# Altium schematic sheet led.SchDoc
size A3; Organization: Develer s.r.l.; Address1: via Mugellese 1/A; Address2: 50019 Campi Bisenzio; Address3: Firenze; Address4: ITALY; Revision: A; SheetNumber: 1; SheetTotal: 1
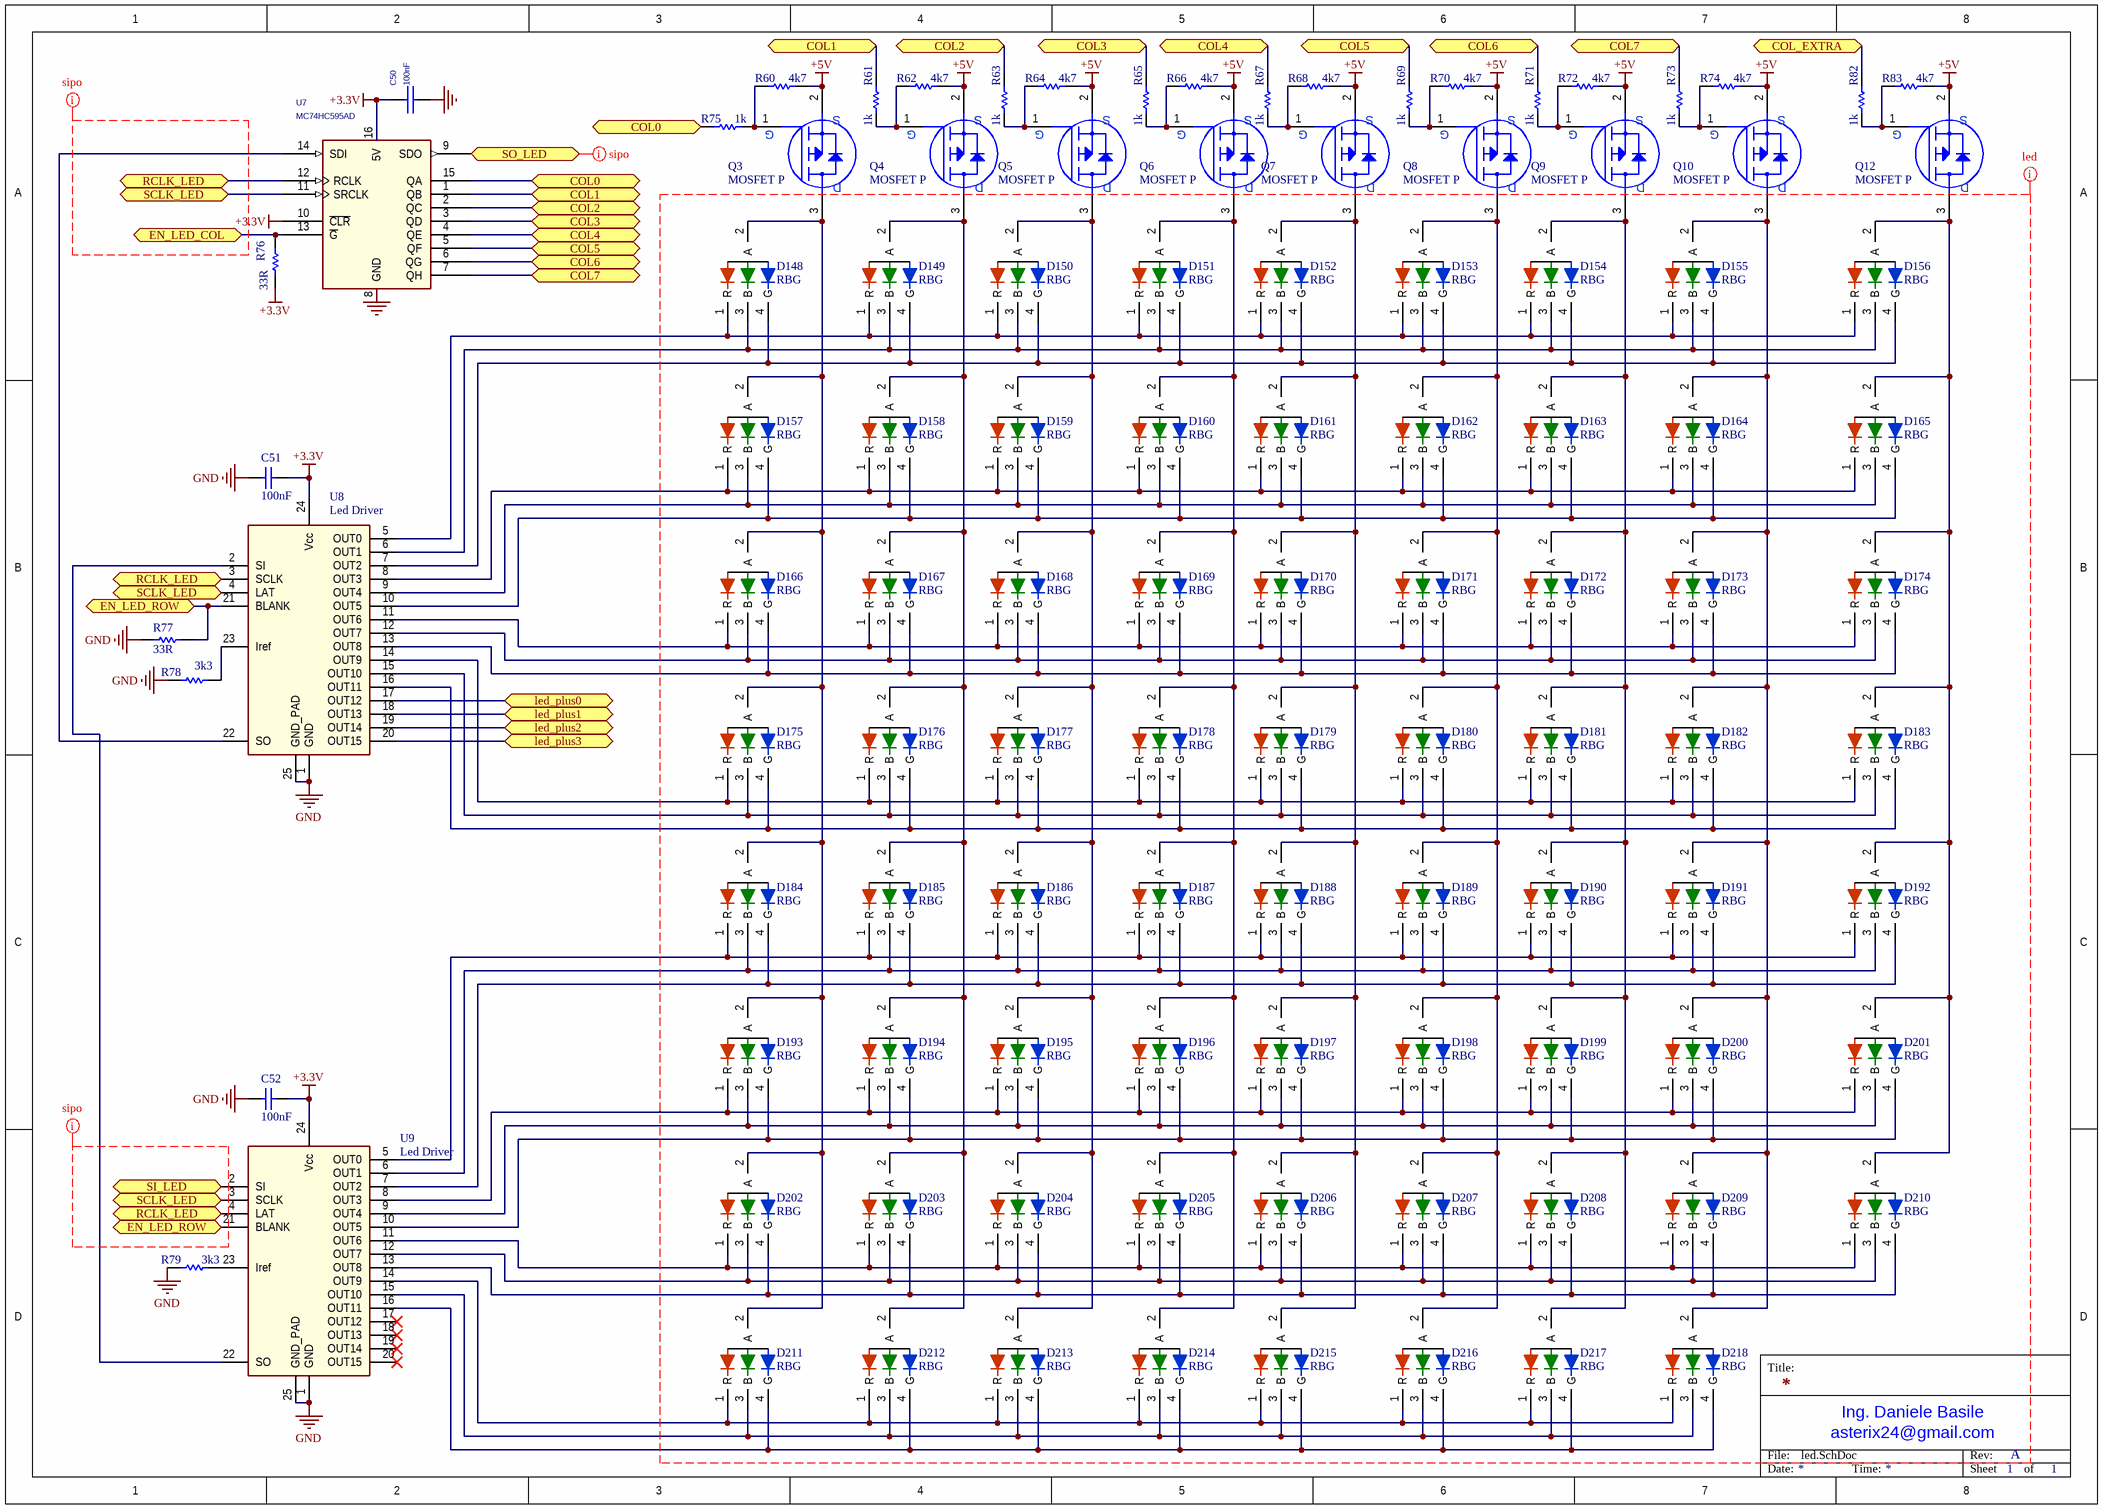
[diagram p0: led.SchDoc]

## Parts
C50  100nF  [0603_[1608]]
C51  100nF  [0603_[1608]]
C52  100nF  [0603_[1608]]
D148  RBG
D149  RBG  [led_3.2x2.8mm_4p_smd]
D150  RBG  [led_3.2x2.8mm_4p_smd]
D151  RBG  [led_3.2x2.8mm_4p_smd]
D152  RBG
D153  RBG  [led_3.2x2.8mm_4p_smd]
D154  RBG
D155  RBG
D156  RBG  [R3_RGB_LED_THD]
D157  RBG  [R3_RGB_LED_THD]
D158  RBG  [R3_RGB_LED_THD]
D159  RBG  [R3_RGB_LED_THD]
D160  RBG
D161  RBG
D162  RBG
D163  RBG
D164  RBG  [led_3.2x2.8mm_4p_smd]
D165  RBG  [R3_RGB_LED_THD]
D166  RBG  [R3_RGB_LED_THD]
D167  RBG  [R3_RGB_LED_THD]
D168  RBG  [R3_RGB_LED_THD]
D169  RBG
D170  RBG
D171  RBG
D172  RBG
D173  RBG  [R3_RGB_LED_THD]
D174  RBG  [R3_RGB_LED_THD]
D175  RBG  [R3_RGB_LED_THD]
D176  RBG  [R3_RGB_LED_THD]
D177  RBG
D178  RBG
D179  RBG
D180  RBG
D181  RBG  [R3_RGB_LED_THD]
D182  RBG  [R3_RGB_LED_THD]
D183  RBG  [R3_RGB_LED_THD]
D184  RBG  [R3_RGB_LED_THD]
D185  RBG
D186  RBG
D187  RBG
D188  RBG
D189  RBG  [R3_RGB_LED_THD]
D190  RBG  [R3_RGB_LED_THD]
D191  RBG  [R3_RGB_LED_THD]
D192  RBG  [R3_RGB_LED_THD]
D193  RBG
D194  RBG
D195  RBG
D196  RBG
D197  RBG  [R3_RGB_LED_THD]
D198  RBG  [R3_RGB_LED_THD]
D199  RBG  [R3_RGB_LED_THD]
D200  RBG  [led_3.2x2.8mm_4p_smd]
D201  RBG  [R3_RGB_LED_THD]
D202  RBG
D203  RBG
D204  RBG
D205  RBG
D206  RBG  [R3_RGB_LED_THD]
D207  RBG  [R3_RGB_LED_THD]
D208  RBG  [R3_RGB_LED_THD]
D209  RBG  [R3_RGB_LED_THD]
D210  RBG
D211  RBG
D212  RBG  [R3_RGB_LED_THD]
D213  RBG  [R3_RGB_LED_THD]
D214  RBG  [R3_RGB_LED_THD]
D215  RBG  [R3_RGB_LED_THD]
D216  RBG  [R3_RGB_LED_THD]
D217  RBG  [R3_RGB_LED_THD]
D218  RBG  [R3_RGB_LED_THD]
Q3  MOSFET P  [SOT-23]
Q4  MOSFET P  [SOT-23]
Q5  MOSFET P  [SOT-23]
Q6  MOSFET P  [SOT-23]
Q7  MOSFET P  [SOT-23]
Q8  MOSFET P  [SOT-23]
Q9  MOSFET P  [SOT-23]
Q10  MOSFET P  [SOT-23]
Q12  MOSFET P  [SOT-23]
R60  4k7  [0603_[1608]]
R61  1k  [0603_[1608]]
R62  4k7  [0603_[1608]]
R63  1k  [0603_[1608]]
R64  4k7  [0603_[1608]]
R65  1k  [0603_[1608]]
R66  4k7  [0603_[1608]]
R67  1k  [0603_[1608]]
R68  4k7  [0603_[1608]]
R69  1k  [0603_[1608]]
R70  4k7  [0603_[1608]]
R71  1k  [0603_[1608]]
R72  4k7  [0603_[1608]]
R73  1k  [0603_[1608]]
R74  4k7  [0603_[1608]]
R75  1k  [0603_[1608]]
R76  33R  [0603_[1608]]
R77  33R  [0603_[1608]]
R78  3k3  [0805_[2012]]
R79  3k3  [0805_[2012]]
R82  1k  [0603_[1608]]
R83  4k7  [0603_[1608]]
U7  MC74HC595AD  [SOIC16]
U8  Led Driver  [TSOP65P640X120_HS-25N]
U9  Led Driver  [TSOP65P640X120_HS-25N]

## Ports
COL0, COL1, COL2, COL3, COL4, COL5, COL6, COL7, COL_EXTRA, EN_LED_COL, EN_LED_ROW, led_plus0, led_plus1, led_plus2, led_plus3, RCLK_LED, SCLK_LED, SI_LED, SO_LED

## Nets
+3.3V: C50.1 C51.2 C52.2 R76.1 U7.10(~{CLR}) U7.16(5V) U8.24(Vcc) U9.24(Vcc)  [also labelled 5V]
+5V: Q3.2(S) Q4.2(S) Q5.2(S) Q6.2(S) Q7.2(S) Q8.2(S) Q9.2(S) Q10.2(S) Q12.2(S) R60.1 R62.1 R64.1 R66.1 R68.1 R70.1 R72.1 R74.1 R83.1
GND: C50.2 C51.1 C52.1 R77.1 R78.1 R79.1 U7.8(GND) U8.1(GND) U8.25(GND_PAD) U9.1(GND) U9.25(GND_PAD)
COL0: R75.2 U7.15(QA) ; port COL0
COL1: R61.1 U7.1(QB) ; port COL1
COL2: R63.1 U7.2(QC) ; port COL2
COL3: R65.1 U7.3(QD) ; port COL3
COL4: R67.1 U7.4(QE) ; port COL4
COL5: R69.1 U7.5(QF) ; port COL5
COL6: R71.1 U7.6(QG) ; port COL6
COL7: R73.1 U7.7(QH) ; port COL7
COL_EXTRA: R82.1 ; port COL_EXTRA
EN_LED_COL: R76.2 U7.13(~{G}) ; port EN_LED_COL
EN_LED_ROW: R77.2 U8.21(BLANK) U9.21(BLANK) ; port EN_LED_ROW
led_plus0: U8.17(OUT12) ; port led_plus0
led_plus1: U8.18(OUT13) ; port led_plus1
led_plus2: U8.19(OUT14) ; port led_plus2
led_plus3: U8.20(OUT15) ; port led_plus3
RCLK_LED: U7.12(RCLK) U8.3(SCLK) U9.4(LAT) ; port RCLK_LED
SCLK_LED: U7.11(SRCLK) U8.4(LAT) U9.3(SCLK) ; port SCLK_LED
SI_LED: U9.2(SI) ; port SI_LED
SO_LED: U7.9(SDO) ; port SO_LED
NetD148_1: D148.1(R) D149.1(R) D150.1(R) D151.1(R) D152.1(R) D153.1(R) D154.1(R) D155.1(R) D156.1(R) U8.5(OUT0)
NetD148_2: D148.2(A) D157.2(A) D166.2(A) D175.2(A) D184.2(A) D193.2(A) D202.2(A) D211.2(A) Q3.3(D)
NetD148_3: D148.3(B) D149.3(B) D150.3(B) D151.3(B) D152.3(B) D153.3(B) D154.3(B) D155.3(B) D156.3(B) U8.6(OUT1)
NetD148_4: D148.4(G) D149.4(G) D150.4(G) D151.4(G) D152.4(G) D153.4(G) D154.4(G) D155.4(G) D156.4(G) U8.7(OUT2)
NetD149_2: D149.2(A) D158.2(A) D167.2(A) D176.2(A) D185.2(A) D194.2(A) D203.2(A) D212.2(A) Q4.3(D)
NetD150_2: D150.2(A) D159.2(A) D168.2(A) D177.2(A) D186.2(A) D195.2(A) D204.2(A) D213.2(A) Q5.3(D)
NetD151_2: D151.2(A) D160.2(A) D169.2(A) D178.2(A) D187.2(A) D196.2(A) D205.2(A) D214.2(A) Q6.3(D)
NetD152_2: D152.2(A) D161.2(A) D170.2(A) D179.2(A) D188.2(A) D197.2(A) D206.2(A) D215.2(A) Q7.3(D)
NetD153_2: D153.2(A) D162.2(A) D171.2(A) D180.2(A) D189.2(A) D198.2(A) D207.2(A) D216.2(A) Q8.3(D)
NetD154_2: D154.2(A) D163.2(A) D172.2(A) D181.2(A) D190.2(A) D199.2(A) D208.2(A) D217.2(A) Q9.3(D)
NetD155_2: D155.2(A) D164.2(A) D173.2(A) D182.2(A) D191.2(A) D200.2(A) D209.2(A) D218.2(A) Q10.3(D)
NetD156_2: D156.2(A) D165.2(A) D174.2(A) D183.2(A) D192.2(A) D201.2(A) D210.2(A) Q12.3(D)
NetD157_1: D157.1(R) D158.1(R) D159.1(R) D160.1(R) D161.1(R) D162.1(R) D163.1(R) D164.1(R) D165.1(R) U8.8(OUT3)
NetD157_3: D157.3(B) D158.3(B) D159.3(B) D160.3(B) D161.3(B) D162.3(B) D163.3(B) D164.3(B) D165.3(B) U8.9(OUT4)
NetD157_4: D157.4(G) D158.4(G) D159.4(G) D160.4(G) D161.4(G) D162.4(G) D163.4(G) D164.4(G) D165.4(G) U8.10(OUT5)
NetD166_1: D166.1(R) D167.1(R) D168.1(R) D169.1(R) D170.1(R) D171.1(R) D172.1(R) D173.1(R) D174.1(R) U8.11(OUT6)
NetD166_3: D166.3(B) D167.3(B) D168.3(B) D169.3(B) D170.3(B) D171.3(B) D172.3(B) D173.3(B) D174.3(B) U8.12(OUT7)
NetD166_4: D166.4(G) D167.4(G) D168.4(G) D169.4(G) D170.4(G) D171.4(G) D172.4(G) D173.4(G) D174.4(G) U8.13(OUT8)
NetD175_1: D175.1(R) D176.1(R) D177.1(R) D178.1(R) D179.1(R) D180.1(R) D181.1(R) D182.1(R) D183.1(R) U8.14(OUT9)
NetD175_3: D175.3(B) D176.3(B) D177.3(B) D178.3(B) D179.3(B) D180.3(B) D181.3(B) D182.3(B) D183.3(B) U8.15(OUT10)
NetD175_4: D175.4(G) D176.4(G) D177.4(G) D178.4(G) D179.4(G) D180.4(G) D181.4(G) D182.4(G) D183.4(G) U8.16(OUT11)
NetD184_1: D184.1(R) D185.1(R) D186.1(R) D187.1(R) D188.1(R) D189.1(R) D190.1(R) D191.1(R) D192.1(R) U9.5(OUT0)
NetD184_3: D184.3(B) D185.3(B) D186.3(B) D187.3(B) D188.3(B) D189.3(B) D190.3(B) D191.3(B) D192.3(B) U9.6(OUT1)
NetD184_4: D184.4(G) D185.4(G) D186.4(G) D187.4(G) D188.4(G) D189.4(G) D190.4(G) D191.4(G) D192.4(G) U9.7(OUT2)
NetD193_1: D193.1(R) D194.1(R) D195.1(R) D196.1(R) D197.1(R) D198.1(R) D199.1(R) D200.1(R) D201.1(R) U9.8(OUT3)
NetD193_3: D193.3(B) D194.3(B) D195.3(B) D196.3(B) D197.3(B) D198.3(B) D199.3(B) D200.3(B) D201.3(B) U9.9(OUT4)
NetD193_4: D193.4(G) D194.4(G) D195.4(G) D196.4(G) D197.4(G) D198.4(G) D199.4(G) D200.4(G) D201.4(G) U9.10(OUT5)
NetD202_1: D202.1(R) D203.1(R) D204.1(R) D205.1(R) D206.1(R) D207.1(R) D208.1(R) D209.1(R) D210.1(R) U9.11(OUT6)
NetD202_3: D202.3(B) D203.3(B) D204.3(B) D205.3(B) D206.3(B) D207.3(B) D208.3(B) D209.3(B) D210.3(B) U9.12(OUT7)
NetD202_4: D202.4(G) D203.4(G) D204.4(G) D205.4(G) D206.4(G) D207.4(G) D208.4(G) D209.4(G) D210.4(G) U9.13(OUT8)
NetD211_1: D211.1(R) D212.1(R) D213.1(R) D214.1(R) D215.1(R) D216.1(R) D217.1(R) D218.1(R) U9.14(OUT9)
NetD211_3: D211.3(B) D212.3(B) D213.3(B) D214.3(B) D215.3(B) D216.3(B) D217.3(B) D218.3(B) U9.15(OUT10)
NetD211_4: D211.4(G) D212.4(G) D213.4(G) D214.4(G) D215.4(G) D216.4(G) D217.4(G) D218.4(G) U9.16(OUT11)
NetQ3_1: Q3.1(G) R60.2 R75.1
NetQ4_1: Q4.1(G) R61.2 R62.2
NetQ5_1: Q5.1(G) R63.2 R64.2
NetQ6_1: Q6.1(G) R65.2 R66.2
NetQ7_1: Q7.1(G) R67.2 R68.2
NetQ8_1: Q8.1(G) R69.2 R70.2
NetQ9_1: Q9.1(G) R71.2 R72.2
NetQ10_1: Q10.1(G) R73.2 R74.2
NetQ12_1: Q12.1(G) R82.2 R83.2
NetR78_2: R78.2 U8.23(Iref)
NetR79_2: R79.2 U9.23(Iref)
NetU7_14: U7.14(SDI) U8.22(SO)
NetU8_2: U8.2(SI) U9.22(SO)

Not connected (* = marked no-connect by the designer): U9 17(OUT12)* 18(OUT13)* 19(OUT14)* 20(OUT15)*

## Layout directives
net class leds: (no net found under the mark)
net class sipo: (no net found under the mark), SO_LED

## Notes on the sheet
- Title:
- File:
- asterix24@gmail.com
- Ing. Daniele Basile
- Rev:
- Date:
- Time:
- Sheet
- of

## Library data of the parts
C50 = C: CER 50V X7R
C51 C52 = Cap: Ceramic X7R 50V; Value: 10nF; Published: 8-Jun-2000; Revision: July-2002: Re-released for DXP Platform.; Publisher: Altium Limited
D148-D218 = Led_RGB_COM_A_THD: Led RGB Thrue Hole
Q3 = MOSFET-P 3pin: IRLML5103TRPbF; DMG1013UW;
Q4-Q10 Q12 = MOSFET-P 3pin
R60 R62 R64 R66 R68 R70 R72 R74 R76-R79 R83 = Res1: Resistor; Value: 1K; Published: 8-Jun-2000; Revision: July-2002: Re-released for DXP Platform.; Publisher: Altium Limited
R61 R63 R65 R67 R69 R71 R73 R75 R82 = Res1: Resistor; Published: 8-Jun-2000; Revision: July-2002: Re-released for DXP Platform.; Publisher: Altium Limited; Value: 1K
U7 = 74HC595_27: 8-Bit Serial-Input/Serial or Prallel-Output Shift Register with Latched 3-State Outputs
U8 U9 = Led_driver: (Texas TLC5928; ST STP16CP05)